# EAGLE design NFCaddonLStop_002 (EAGLE 6.5.0)
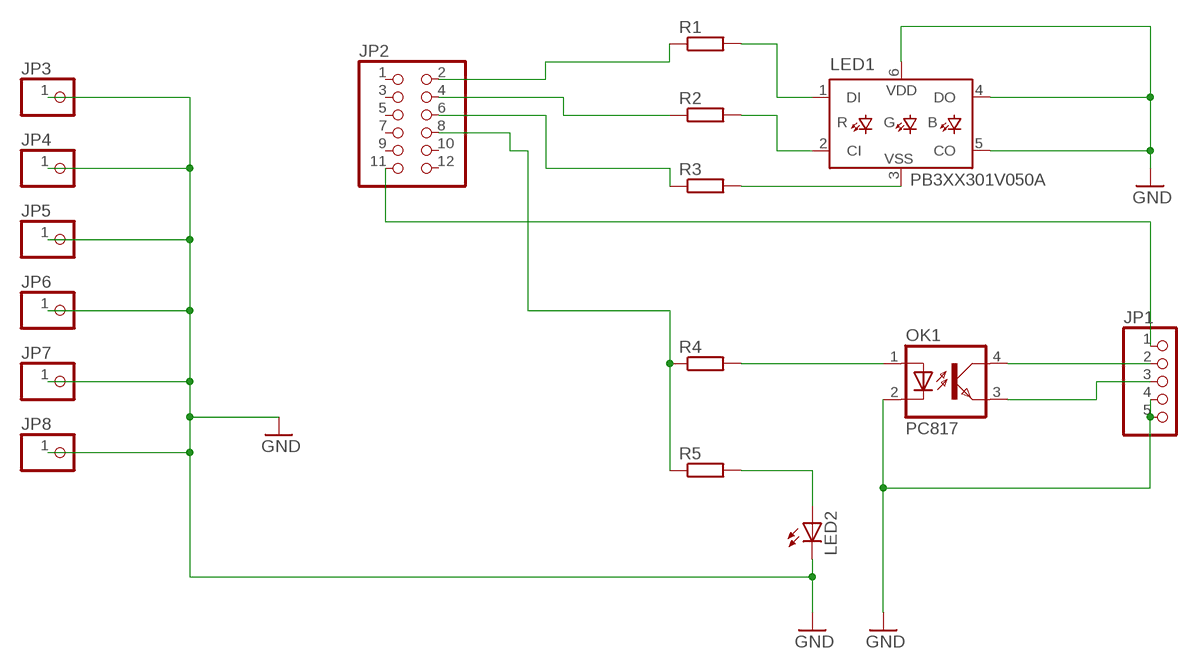
[diagram p0: schematic, sheet 1]

## Parts
JP1  PINHD-1X5/90  [1X05/90]
JP2  PINHD-2X6  [2X06]
JP3  PINHD-1X1  [1X01]
JP4  PINHD-1X1  [1X01]
JP5  PINHD-1X1  [1X01]
JP6  PINHD-1X1  [1X01]
JP7  PINHD-1X1  [1X01]
JP8  PINHD-1X1  [1X01]
LED1  PB3XX301V050A  [PB3XX301V050A]
LED2  LEDCHIPLED_1206  [CHIPLED_1206]
OK1  PC817  [DIL04]
R1  R-EU_M1206  [M1206]
R2  R-EU_M1206  [M1206]
R3  R-EU_M1206  [M1206]
R4  R-EU_M1206  [M1206]
R5  R-EU_M1206  [M1206]

## Nets
GND: JP1.4 JP1.5 JP3.1 JP4.1 JP5.1 JP6.1 JP7.1 JP8.1 LED1.4(DO) LED1.5(CO) LED1.6(VDD) LED2.C OK1.2(C)
N$1: JP2.2 R1.1
N$2: JP2.4 R2.1
N$3: JP2.6 R3.1
N$4: LED1.1(DI) R1.2
N$5: LED1.2(CI) R2.2
N$6: LED1.3(VSS) R3.2
N$7: JP2.8 R4.1 R5.1
N$8: OK1.1(A) R4.2
N$9: LED2.A R5.2
N$10: JP1.2 OK1.4(COL)
N$11: JP1.3 OK1.3(EMIT)
N$12: JP1.1 JP2.11
Unconnected: JP2.1 JP2.3 JP2.5 JP2.7 JP2.9 JP2.10 JP2.12

## Library data of the parts
JP1 = pinhead:PINHD-1X5: PIN HEADER
JP2 = pinhead:PINHD-2X6: PIN HEADER
JP3-JP8 = pinhead:PINHD-1X1: PIN HEADER
LED1 = led:PB3XX301V050A: Self-addressed led , single point control with integrated RGB leds and drive IC Easy control by MCU. Source: DycolED.pdf Data sheet <http://www.kirronlightcomponents.com/index.php/download_file/view/41/83/>
LED2 = led:LED: LED OSRAM: - CHIPLED LG R971, LG N971, LY N971, LG Q971, LY Q971, LO R971, LY R971 LH N974, LH R974 LS Q976, LO Q976, LY Q976 LO Q996 - Hyper CHIPLED LW Q18S LB Q993, LB Q99A, LB R99A - SideLED LS A670, LO A670, LY A670, LG A670, LP A670 LB A673, LV A673, LT A673, LW A673 LH A674 LY A675 LS A676, LA A676, LO A676, LY A676, LW A676 LS A679, LY A679, LG A679 - Hyper Micro SIDELED® LS Y876, LA Y876, LO Y876, LY Y876 LT Y87S - SmartLED LW L88C, LW L88S LB L89C, LB L89S, LG L890 LS L89K, LO L89K, LY L89K LS L896, LA L896, LO L896, LY L896 - TOPLED LS T670, LO T670, LY T670, LG T670, LP T670 LSG T670, LSP T670, LSY T670, LOP T670, LYG T670 LG T671, LOG T671, LSG T671 LB T673, LV T673, LT T673, LW T673 LH T674 LS T676, LA T676, LO T676, LY T676, LB T676, LH T676, LSB T676, LW T676 LB T67C, LV T67C, LT T67C, LS T67K, LO T67K, LY T67K, LW E67C LS E67B, LA E67B, LO E67B, LY E67B, LB E67C, LV E67C, LT E67C LW T67C LS T679, LY T679, LG T679 LS T770, LO T770, LY T770, LG T770, LP T770 LB T773, LV T773, LT T773, LW T773 LH T774 LS E675, LA E675, LY E675, LS T675 LS T776, LA T776, LO T776, LY T776, LB T776 LHGB T686 LT T68C, LB T68C - Hyper Mini TOPLED® LB M676 - Mini TOPLED Santana® LG M470 LS M47K, LO M47K, LY M47K Source: http://www.osram.convergy.de LUXEON: - LUMILED® LXK2-PW12-R00, LXK2-PW12-S00, LXK2-PW14-U00, LXK2-PW14-V00 LXK2-PM12-R00, LXK2-PM12-S00, LXK2-PM14-U00 LXK2-PE12-Q00, LXK2-PE12-R00, LXK2-PE12-S00, LXK2-PE14-T00, LXK2-PE14-U00 LXK2-PB12-K00, LXK2-PB12-L00, LXK2-PB12-M00, LXK2-PB14-N00, LXK2-PB14-P00, LXK2-PB14-Q00 LXK2-PR12-L00, LXK2-PR12-M00, LXK2-PR14-Q00, LXK2-PR14-R00 LXK2-PD12-Q00, LXK2-PD12-R00, LXK2-PD12-S00 LXK2-PH12-R00, LXK2-PH12-S00 LXK2-PL12-P00, LXK2-PL12-Q00, LXK2-PL12-R00 Source: www.luxeon.com KINGBRIGHT: KA-3528ASYC Source: www.kingbright.com
OK1 = optocoupler:PC817: SHARP OPTO COUPLER; MPN: PC817X4J000F; OC_FARNELL: 9707727; OC_NEWARK: 97K7059
R1-R5 = rcl:R-EU_: RESISTOR, European symbol

## Board
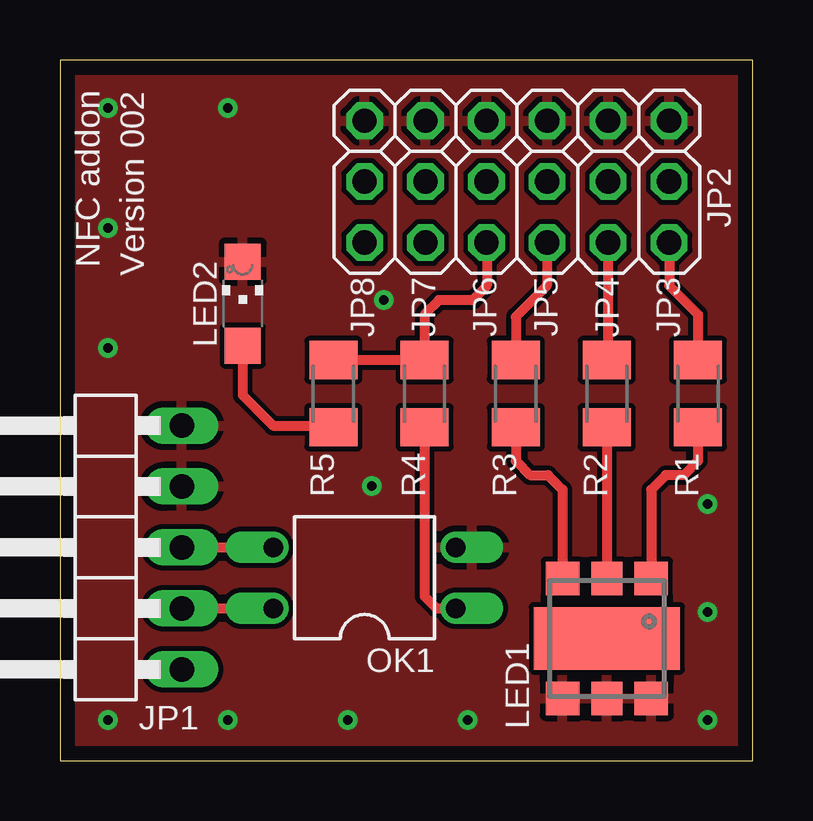
[diagram p1: board, top side]
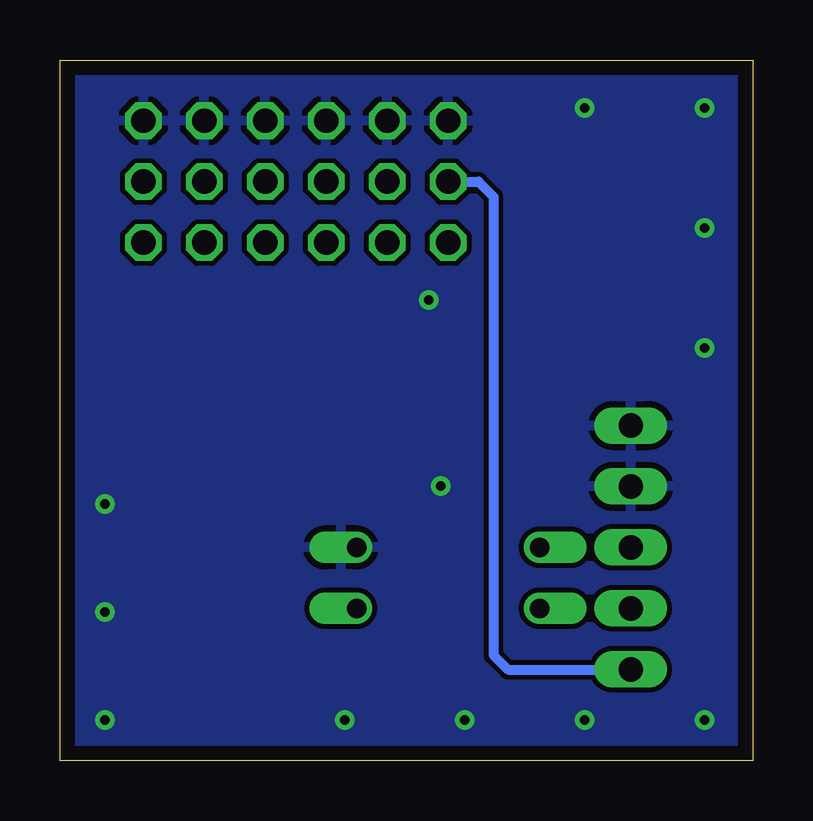
[diagram p2: board, bottom side, seen from below]

Size 28.88 x 29.2 mm. Coordinates in mm from the lower left corner, seen from the top.
Outline: 0,0 28.88,0 28.88,29.2 0,29.2 0,0
Copper layers (1*16): Top 0.035mm / dielectric 1.5mm / Bottom 0.035mm
Design rules "default *": minimum track width 10mil, minimum drill 12mil, track to track 8mil, track to pad 8mil, pad to pad 8mil, via to via 8mil, smd to smd 8mil, copper to edge 24mil, drill to drill 8mil, minimum pad ring 10mil, minimum via ring 8mil, stop-mask expansion 4mil, vias tented up to drill 0mil, thermal gap 10mil

### Footprints (pad centres in the part's own frame; a part is rotated, then mirrored left to right if it is on the bottom)
1X05/90 = drill 1.016 long: 1 -5.08,-3.81; 2 -2.54,-3.81; 3 0,-3.81; 4 2.54,-3.81; 5 5.08,-3.81
2X06 = drill 1.016 octagon: 1 -6.35,-1.27; 2 -6.35,1.27; 3 -3.81,-1.27; 4 -3.81,1.27; 5 -1.27,-1.27; 6 -1.27,1.27; 7 1.27,-1.27; 8 1.27,1.27; 9 3.81,-1.27; 10 3.81,1.27; 11 6.35,-1.27; 12 6.35,1.27
1X01 = drill 1.016 octagon: 1 0,0
PB3XX301V050A = smd 1.4 x 1.4: 1 -1.85,-2.5; 3 1.85,-2.5; 4 -1.85,2.5; 6 1.85,2.5 | smd 1.3 x 1.4: 2 0,-2.5; 5 0,2.5 | smd 6.1 x 2.6: HT 0,0
CHIPLED_1206 = smd 1.5 x 1.5: A 0,-1.75; C 0,1.75
DIL04 = drill 0.813 offset: 1 -1.27,-3.81; 2 1.27,-3.81; 3 1.27,3.81; 4 -1.27,3.81
M1206 = smd 1.6 x 2: 1 -1.4,0; 2 1.4,0

### Placement (x,y rotation side)
JP1  1.27,8.89 90 top
JP2  19.05,22.86 180 top
JP3  25.4,26.67 0 top
JP4  22.86,26.67 0 top
JP5  20.32,26.67 0 top
JP6  17.78,26.67 0 top
JP7  15.24,26.67 0 top
JP8  12.7,26.67 0 top
LED1  22.8,5.1 180 top
LED2  7.62,19.05 0 top
OK1  12.7,7.62 90 top
R1  26.6,15.3 270 top
R2  22.8,15.3 270 top
R3  19,15.3 270 top
R4  15.2,15.3 270 top
R5  11.4,15.3 270 top

### Tracks (layer width: path | path; a pad name or v marks a point on that pad's centre or on a via)
GND  (via drill 0.4)
  other vias: 2,27.2 2,22.2 2,17.2 7,27.2 27,1.7 27,6.2 27,10.7 2,1.7 7,1.7 12,1.7 17,1.7 13,11.45 13.5,19.2
  pour Bottom: 0.25,28.96 0.25,0.25 28.66,0.25 28.66,28.96
  pour Top: 0.25,28.96 0.25,0.25 28.66,0.25 28.66,28.96
N$1
  Top 0.406: JP2.2 25.4,19.8 26.6,18.6 R1.1
N$2
  Top 0.406: JP2.4 22.86,21.56 22.85,21.55 22.85,16.7 R2.1
N$3
  Top 0.406: JP2.6 20.3,21.6 20.3,19.8 19,18.5 R3.1
N$4
  Top 0.406: R1.2 26.6,12.5 26,11.9 25.25,11.9 24.65,11.3 LED1.1
N$5
  Top 0.406: R2.2 LED1.2
N$6
  Top 0.406: R3.2 19,12.5 19.6,11.9 20.35,11.9 20.95,11.3 LED1.3
N$7
  Top 0.406: R4.1 R5.1 | JP2.8 17.8,21.6 17.8,19.8 17.2,19.2 15.8,19.2 15.2,18.6 R4.1 | 15.2,16.68 R4.1
N$8
  Top 0.406: R4.2 15.2,6.85 15.7,6.35 OK1.1
N$9
  Top 0.406: LED2.A 7.62,15.24 8.89,13.97 11.43,13.97 R5.2
N$10
  Top 0.406: JP1.2 OK1.4
N$11
  Top 0.406: JP1.3 OK1.3
N$12
  Bottom 0.406: JP2.11 11.43,24.13 10.8,23.5 10.8,4.4 10.2,3.8 5.12,3.8 JP1.1

### Text on the board
tPlace: NFC addon | Version 002